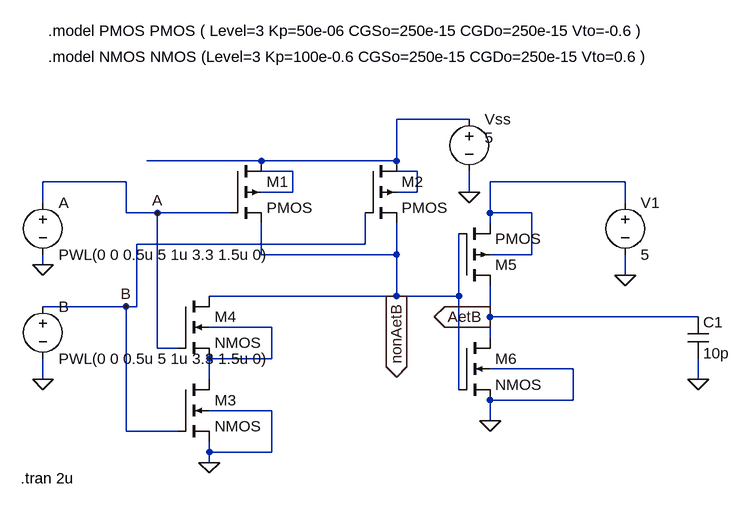
[diagram p0: schematic AND.asc]
AND.asc, the LTspice schematic file:
Version 4
SHEET 1 1512 680
WIRE 512 -80 400 -80
WIRE 192 -16 16 -16
WIRE 400 -16 400 -80
WIRE 400 -16 192 -16
WIRE 240 0 192 0
WIRE 432 0 400 0
WIRE -16 16 -144 16
WIRE 752 16 544 16
WIRE 240 32 240 0
WIRE 240 32 192 32
WIRE 432 32 432 0
WIRE 432 32 400 32
WIRE 512 32 512 0
WIRE -144 48 -144 16
WIRE 752 48 752 16
WIRE -16 64 -16 16
WIRE 32 64 -16 64
WIRE 144 64 32 64
WIRE 544 64 544 16
WIRE 608 64 544 64
WIRE 544 80 544 64
WIRE 352 112 352 64
WIRE 352 112 0 112
WIRE 192 128 192 80
WIRE 400 128 400 80
WIRE 400 128 192 128
WIRE 608 128 608 64
WIRE 608 128 544 128
WIRE -144 144 -144 128
WIRE 752 160 752 128
WIRE 400 192 400 128
WIRE 400 192 112 192
WIRE 496 192 496 96
WIRE 496 192 400 192
WIRE -16 208 -144 208
WIRE 0 208 0 112
WIRE 0 208 -16 208
WIRE 544 224 544 176
WIRE 864 224 544 224
WIRE 208 240 112 240
WIRE 544 256 544 224
WIRE 32 272 32 64
WIRE 64 272 32 272
WIRE 208 288 208 240
WIRE 208 288 112 288
WIRE 672 304 544 304
WIRE -144 320 -144 288
WIRE 112 320 112 288
WIRE 864 320 864 288
WIRE 496 336 496 192
WIRE 672 352 672 304
WIRE 672 352 544 352
WIRE 208 368 112 368
WIRE 544 384 544 352
WIRE -16 400 -16 208
WIRE 64 400 -16 400
WIRE 112 432 112 416
WIRE 208 432 208 368
WIRE 208 432 112 432
WIRE 112 448 112 432
FLAG 512 32 0
FLAG 112 448 0
FLAG -144 320 0
FLAG -144 144 0
FLAG 544 384 0
FLAG 400 192 nonAetB
IOPIN 400 192 Out
FLAG 544 224 AetB
IOPIN 544 224 Out
FLAG 864 320 0
FLAG 32 64 A
FLAG -16 208 B
FLAG 752 160 0
SYMBOL pmos4 144 -16 R0
SYMATTR InstName M1
SYMATTR Value2 l=0.75u w=3.75u
SYMBOL pmos4 352 -16 R0
SYMATTR InstName M2
SYMATTR Value2 l=0.75u w=3.75u
SYMBOL nmos4 64 320 R0
SYMATTR InstName M3
SYMATTR Value2 l=0.75u w=1.5u
SYMBOL nmos4 64 192 R0
SYMATTR InstName M4
SYMATTR Value2 l=0.75u w=1.5u
SYMBOL voltage 512 -96 R0
WINDOW 123 0 0 Left 0
WINDOW 39 0 0 Left 0
WINDOW 3 24 44 Left 2
SYMATTR Value 5
SYMATTR InstName Vss
SYMBOL voltage -144 32 R0
WINDOW 123 0 0 Left 0
WINDOW 39 0 0 Left 0
SYMATTR InstName A
SYMATTR Value PWL(0 0 0.5u 5 1u 3.3 1.5u 0)
SYMBOL voltage -144 192 R0
WINDOW 123 0 0 Left 0
WINDOW 39 0 0 Left 0
SYMATTR InstName B
SYMATTR Value PWL(0 0 0.5u 5 1u 3.3 1.5u 0)
SYMBOL pmos4 496 176 M180
SYMATTR InstName M5
SYMATTR Value2 l=0.75u w=3.75u
SYMBOL nmos4 496 256 R0
SYMATTR InstName M6
SYMATTR Value2 l=0.75u w=1.5u
SYMBOL cap 848 224 R0
SYMATTR InstName C1
SYMATTR Value 10p
SYMBOL voltage 752 32 R0
WINDOW 123 0 0 Left 0
WINDOW 39 0 0 Left 0
SYMATTR InstName V1
SYMATTR Value 5
TEXT -136 -176 Left 2 !.model NMOS NMOS (Level=3 Kp=100e-0.6 CGSo=250e-15 CGDo=250e-15 Vto=0.6 )
TEXT -136 -216 Left 2 !.model PMOS PMOS ( Level=3 Kp=50e-06 CGSo=250e-15 CGDo=250e-15 Vto=-0.6 )
TEXT -178 472 Left 2 !.tran 2u

The netlist it stands for:
* AND.asc
M1 N001 A nonAetB N002 PMOS l=0.75u w=3.75u
M2 N001 B nonAetB N003 PMOS l=0.75u w=3.75u
M3 N005 B 0 0 NMOS l=0.75u w=1.5u
M4 nonAetB A N005 N005 NMOS l=0.75u w=1.5u
Vss N001 0 5
V§A A 0 PWL(0 0 0.5u 5 1u 3.3 1.5u 0)
V§B B 0 PWL(0 0 0.5u 5 1u 3.3 1.5u 0)
M5 AetB nonAetB N004 N004 PMOS l=0.75u w=3.75u
M6 AetB nonAetB 0 0 NMOS l=0.75u w=1.5u
C1 AetB 0 10p
V1 N004 0 5
.model NMOS NMOS
.model PMOS PMOS
.lib standard.mos
.model NMOS NMOS (Level=3 Kp=100e-0.6 CGSo=250e-15 CGDo=250e-15 Vto=0.6 )
.model PMOS PMOS ( Level=3 Kp=50e-06 CGSo=250e-15 CGDo=250e-15 Vto=-0.6 )
.tran 2u
.backanno
.end